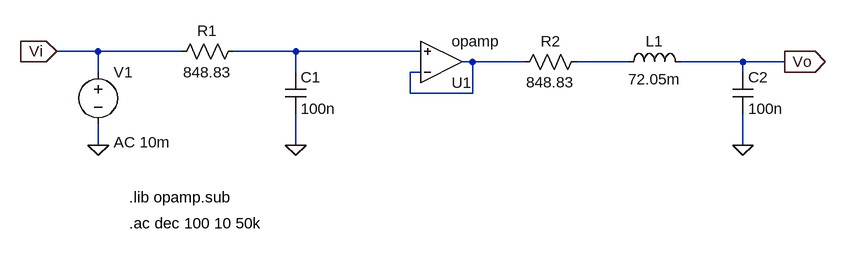
[diagram p0: schematic TS3_b.asc]
TS3_b.asc, the LTspice schematic file:
Version 4
SHEET 1 1052 680
WIRE -96 128 -160 128
WIRE 32 128 -96 128
WIRE 208 128 112 128
WIRE 400 128 208 128
WIRE 480 144 464 144
WIRE 560 144 480 144
WIRE 720 144 640 144
WIRE 896 144 800 144
WIRE 960 144 896 144
WIRE -96 160 -96 128
WIRE 208 160 208 128
WIRE 400 160 384 160
WIRE 896 160 896 144
WIRE 384 192 384 160
WIRE 480 192 480 144
WIRE 480 192 384 192
WIRE -96 272 -96 240
WIRE 208 272 208 224
WIRE 896 272 896 224
FLAG 208 272 0
FLAG 896 272 0
FLAG -96 272 0
FLAG -160 128 Vi
IOPIN -160 128 In
FLAG 960 144 Vo
IOPIN 960 144 Out
SYMBOL cap 192 160 R0
SYMATTR InstName C1
SYMATTR Value 100n
SYMBOL res 128 112 R90
WINDOW 0 0 56 VBottom 2
WINDOW 3 32 56 VTop 2
SYMATTR InstName R1
SYMATTR Value 848.83
SYMBOL OpAmps\\opamp 432 208 M180
SYMATTR InstName U1
SYMBOL res 656 128 R90
WINDOW 0 0 56 VBottom 2
WINDOW 3 32 56 VTop 2
SYMATTR InstName R2
SYMATTR Value 848.83
SYMBOL ind 704 160 R270
WINDOW 0 32 56 VTop 2
WINDOW 3 5 56 VBottom 2
SYMATTR InstName L1
SYMATTR Value 72.05m
SYMBOL cap 880 160 R0
SYMATTR InstName C2
SYMATTR Value 100n
SYMBOL voltage -96 144 R0
WINDOW 123 24 124 Left 2
WINDOW 39 0 0 Left 0
SYMATTR Value2 AC 10m
SYMATTR InstName V1
SYMATTR Value ""
TEXT -48 352 Left 2 !.lib opamp.sub
TEXT -48 392 Left 2 !.ac dec 100 10 50k

The netlist it stands for:
* TS3_b.asc
C1 N001 0 100n
R1 N001 Vi 848.83
XU1 N002 N001 N002 opamp Aol=100K GBW=10Meg  ; pins invin noninvin out
R2 N003 N002 848.83
L1 N003 Vo 72.05m
C2 Vo 0 100n
V1 Vi 0 AC 10m
.lib opamp.sub
.ac dec 100 10 50k
.backanno
.end